# Altium schematic sheet CODEC.SchDoc
size A4; Organization: Altium Limited; Address1: L3, 12a Rodborough Rd; Address2: Frenchs Forest; Address3: NSW; Address4: Australia 2086
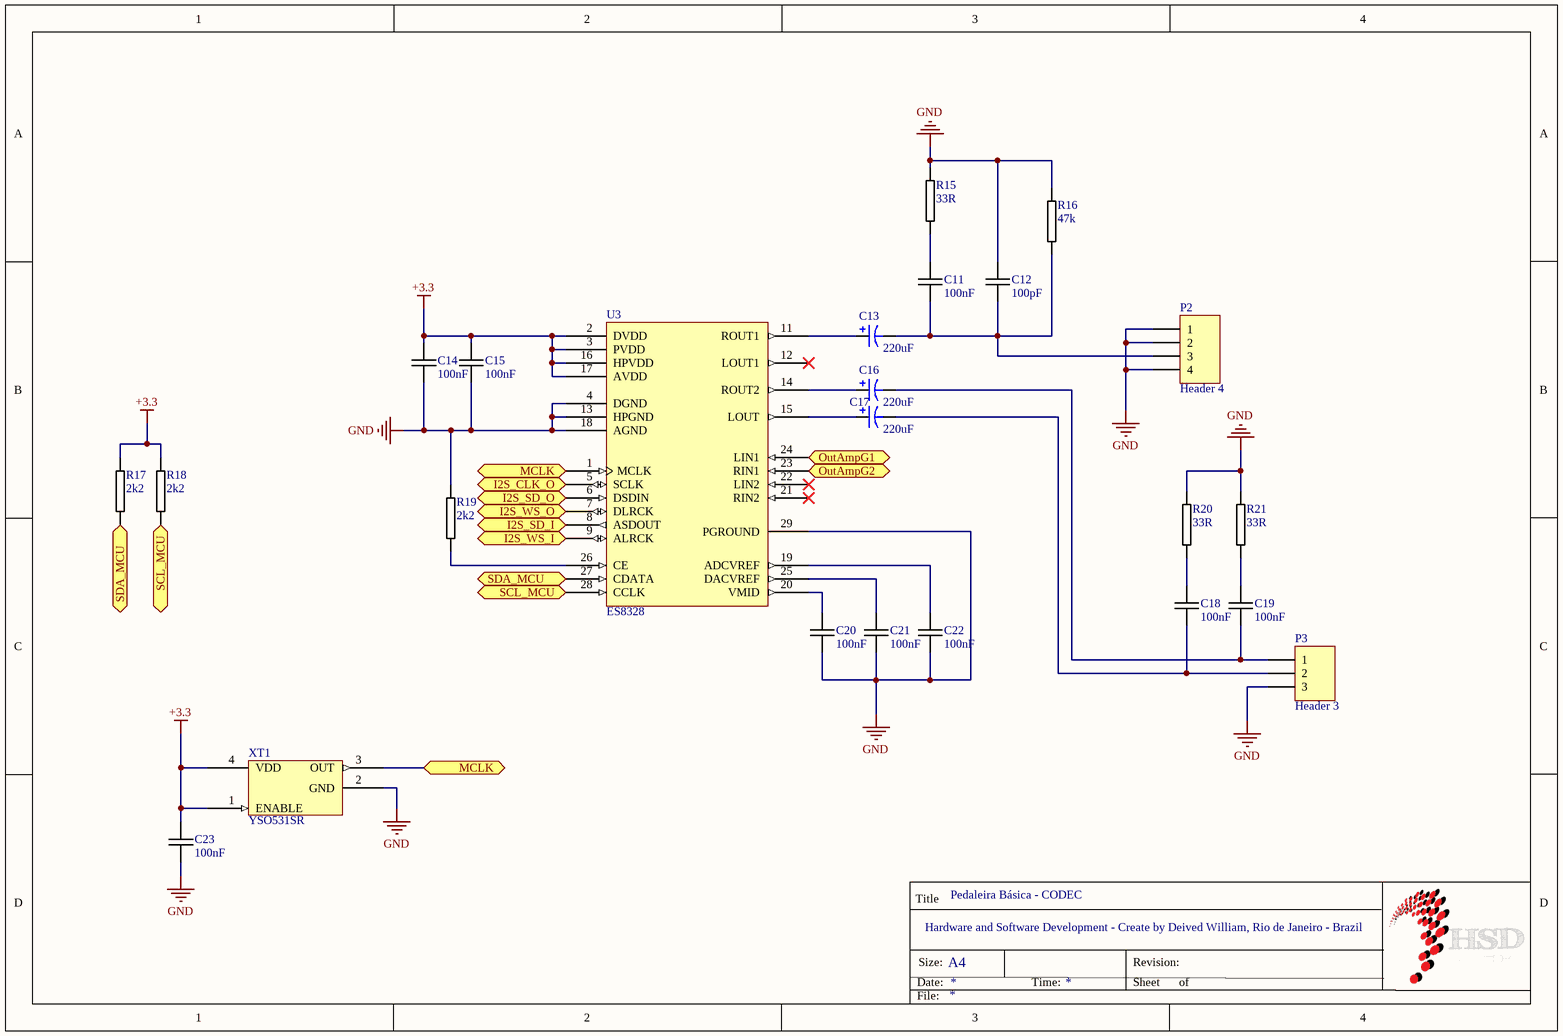
[diagram p0: CODEC.SchDoc]

## Parts
C11  100nF  [0603C-GENERIC]
C12  100pF  [0603C-GENERIC]
C13  220uF  [D]
C14  100nF  [0603C-GENERIC]
C15  100nF  [0603C-GENERIC]
C16  220uF  [D]
C17  220uF  [D]
C18  100nF  [0603C-GENERIC]
C19  100nF  [0603C-GENERIC]
C20  100nF  [0603C-GENERIC]
C21  100nF  [0603C-GENERIC]
C22  100nF  [0603C-GENERIC]
C23  100nF  [0603C-GENERIC]
P2  Header 4  [JACK P10 PLUG]
P3  Header 3  [HDR1X3]
R15  33R  [0603R-100]
R16  47k  [0603R-100]
R17  2k2  [0603R-100]
R18  2k2  [0603R-100]
R19  2k2  [0603R-100]
R20  33R  [0603R-100]
R21  33R  [0603R-100]
U3  ES8328  [QFN-28L]
XT1  YSO531SR  [CRISTAL]

## Ports
I2S_CLK_O, I2S_SD_I, I2S_SD_O, I2S_WS_I, I2S_WS_O, MCLK, OutAmpG1, OutAmpG2, SCL_MCU, SDA_MCU

## Nets
+3.3: C14.1 C15.1 C23.1 R17.1 R18.1 U3.2(DVDD) U3.3(PVDD) U3.16(HPVDD) U3.17(AVDD) XT1.1(ENABLE) XT1.4(VDD)
GND: C12.1 C14.2 C15.2 C20.2 C21.2 C22.2 C23.2 P2.1 P2.2 P2.4 P3.3 R15.1 R16.1 R19.2 R20.1 R21.1 U3.4(DGND) U3.13(HPGND) U3.18(AGND) U3.29(PGROUND) XT1.2(GND)
I2S_CLK_O: U3.5(SCLK) ; port I2S_CLK_O
I2S_SD_I: U3.8(ASDOUT) ; port I2S_SD_I
I2S_SD_O: U3.6(DSDIN) ; port I2S_SD_O
I2S_WS_I: U3.9(ALRCK) ; port I2S_WS_I
I2S_WS_O: U3.7(DLRCK) ; port I2S_WS_O
MCLK: U3.1(MCLK) XT1.3(OUT) ; port MCLK
OutAmpG1: U3.24(LIN1) ; port OutAmpG1
OutAmpG2: U3.23(RIN1) ; port OutAmpG2
SCL_MCU: R18.2 U3.28(CCLK) ; port SCL_MCU
SDA_MCU: R17.2 U3.27(CDATA) ; port SDA_MCU
NetC11_1: C11.1 R15.2
NetC11_2: C11.2 C12.2 C13.2 P2.3 R16.2
NetC13_1: C13.1 U3.11(ROUT1)
NetC16_1: C16.1 U3.14(ROUT2)
NetC16_2: C16.2 C19.2 P3.1
NetC17_1: C17.1 U3.15(LOUT)
NetC17_2: C17.2 C18.2 P3.2
NetC18_1: C18.1 R20.2
NetC19_1: C19.1 R21.2
NetC20_1: C20.1 U3.20(VMID)
NetC21_1: C21.1 U3.25(DACVREF)
NetC22_1: C22.1 U3.19(ADCVREF)
NetR19_1: R19.1 U3.26(CE)

Not connected (* = marked no-connect by the designer): U3 12(LOUT1)* 21(RIN2)* 22(LIN2)*

## Notes on the sheet
- Pedaleira Básica - CODEC
- Title
- Date:
- Size:
- Hardware and Software Development - Create by Deived William, Rio de Janeiro - Brazil
- A4
- Time:
- Revision:
- Sheet
- of
- File:

## Library data of the parts
C11 C12 C14 C15 C18-C23 = 0603C-100NF-25V-X7R-TDK: CAPACITOR 0603 CERAMIC; Manufacturer Part Number: C1608X7R1E104K; Manufacturer: TDK Corporation; Reel: C12; Supplier 1: Digi-Key; Supplier Part Number 1: 445-1316-2-ND
C13 C16 C17 = CC106D004M: Conformal Coated Solid Tantalum Chip Capacitor: Standard Range, 10uF, 20% Tolerance, 4 WVDC @ -55°C to +85°C, Surge = 5V; Note: See Data Sheet for full range of components; Published: 19-Mar-2004; DatasheetDocument: 21-Mar-2002; PackageReference: D; Publisher: Altium Limited; ComponentLink1Description: Manufacturer Link; ComponentLink1URL: http://www.vishay.com/; ComponentLink2Description: Datasheet; ComponentLink2URL: http://www.vishay.com/docs/43017/ccec.pdf; Value: 10uF
P2 = Header 4: Header, 4-Pin; LatestRevisionDate: 17-Jul-2002; LatestRevisionNote: Re-released for DXP Platform.; Publisher: Altium Limited
P3 = Header 3: Header, 3-Pin; LatestRevisionDate: 17-Jul-2002; LatestRevisionNote: Re-released for DXP Platform.; Publisher: Altium Limited
R15-R21 = 0603R-100: GENERIC RESISTOR 0603; Manufacturer Part Number: RMCF 1/16 100 1% R; Manufacturer: Stackpole Electronics Inc; Reel: R24; Supplier 1: Digi-Key; Supplier Part Number 1: RMCF1/16100FRDKR-ND
U3 = ES8328: Low Power Estereo Audio Codec With HeadPhone Amplifier
XT1 = YSO531SR: Cristal Oscilator Active 1.8v - 3.3v